# EAGLE schematic LEDController-REV2-SCH (EAGLE 9.7.0)

## Sheet 1 of 10
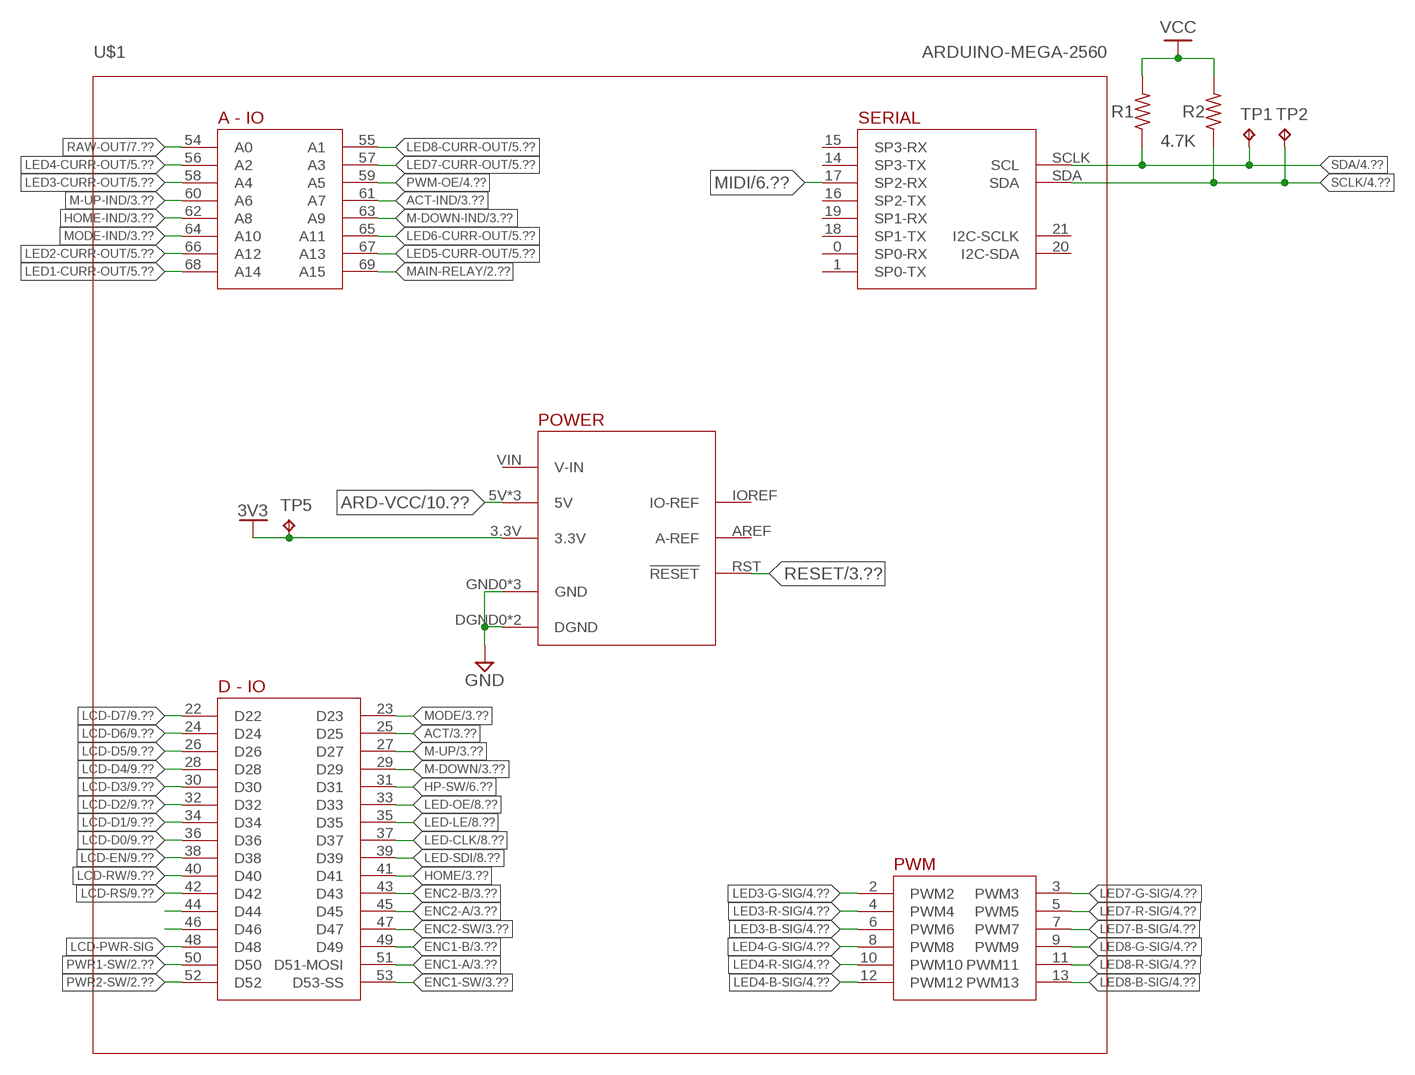
[diagram p0: schematic, sheet 1]

### Parts
R1  4.7K  R-US_CHIP-0805(2012-METRIC)  [RESC2012X65]
R2  4.7K  R-US_CHIP-0805(2012-METRIC)  [RESC2012X65]
TP1  TPTP10R  [TP10R]
TP2  TPTP10R  [TP10R]
TP5  TPTP10R  [TP10R]
U$1  ARDUINO-MEGA-2560  [ARDUINO-MEGA-2560]

### Nets
3V3: TP5.TP U$1.3.3V
ACT: U$1.25(D25) ; also sheet 3
ACT-IND: U$1.61(A7) ; also sheet 3
ARD-VCC: U$1.5V U$1.5VD1(5V) U$1.5VD2(5V) ; also sheet 10
ENC1-A: U$1.51(D51-MOSI) ; also sheet 3
ENC1-B: U$1.49(D49) ; also sheet 3
ENC1-SW: U$1.53(D53-SS) ; also sheet 3
ENC2-A: U$1.45(D45) ; also sheet 3
ENC2-B: U$1.43(D43) ; also sheet 3
ENC2-SW: U$1.47(D47) ; also sheet 3
GND: U$1.DGND0(DGND) U$1.DGND1(DGND) U$1.GND0(GND) U$1.GND1(GND) U$1.GND2(GND) ; also sheet 2,3,4,5,6,7,8,9,10
HOME: U$1.41(D41) ; also sheet 3
HOME-IND: U$1.62(A8) ; also sheet 3
HP-SW: U$1.31(D31) ; also sheet 6
LCD-D0: U$1.36(D36) ; also sheet 9
LCD-D1: U$1.34(D34) ; also sheet 9
LCD-D2: U$1.32(D32) ; also sheet 9
LCD-D3: U$1.30(D30) ; also sheet 9
LCD-D4: U$1.28(D28) ; also sheet 9
LCD-D5: U$1.26(D26) ; also sheet 9
LCD-D6: U$1.24(D24) ; also sheet 9
LCD-D7: U$1.22(D22) ; also sheet 9
LCD-EN: U$1.38(D38) ; also sheet 9
LCD-PWR-SIG: U$1.48(D48)
LCD-RS: U$1.42(D42) ; also sheet 9
LCD-RW: U$1.40(D40) ; also sheet 9
LED1-CURR-OUT: U$1.68(A14) ; also sheet 5
LED2-CURR-OUT: U$1.66(A12) ; also sheet 5
LED3-B-SIG: U$1.6(PWM6) ; also sheet 4
LED3-CURR-OUT: U$1.58(A4) ; also sheet 5
LED3-G-SIG: U$1.2(PWM2) ; also sheet 4
LED3-R-SIG: U$1.4(PWM4) ; also sheet 4
LED4-B-SIG: U$1.12(PWM12) ; also sheet 4
LED4-CURR-OUT: U$1.56(A2) ; also sheet 5
LED4-G-SIG: U$1.8(PWM8) ; also sheet 4
LED4-R-SIG: U$1.10(PWM10) ; also sheet 4
LED5-CURR-OUT: U$1.67(A13) ; also sheet 5
LED6-CURR-OUT: U$1.65(A11) ; also sheet 5
LED7-B-SIG: U$1.7(PWM7) ; also sheet 4
LED7-CURR-OUT: U$1.57(A3) ; also sheet 5
LED7-G-SIG: U$1.3(PWM3) ; also sheet 4
LED7-R-SIG: U$1.5(PWM5) ; also sheet 4
LED8-B-SIG: U$1.13(PWM13) ; also sheet 4
LED8-CURR-OUT: U$1.55(A1) ; also sheet 5
LED8-G-SIG: U$1.9(PWM9) ; also sheet 4
LED8-R-SIG: U$1.11(PWM11) ; also sheet 4
LED-CLK: U$1.37(D37) ; also sheet 8
LED-LE: U$1.35(D35) ; also sheet 8
LED-OE: U$1.33(D33) ; also sheet 8
LED-SDI: U$1.39(D39) ; also sheet 8
M-DOWN: U$1.29(D29) ; also sheet 3
M-DOWN-IND: U$1.63(A9) ; also sheet 3
M-UP: U$1.27(D27) ; also sheet 3
M-UP-IND: U$1.60(A6) ; also sheet 3
MAIN-RELAY: U$1.69(A15) ; also sheet 2
MIDI: U$1.17(SP2-RX) ; also sheet 6
MODE: U$1.23(D23) ; also sheet 3
MODE-IND: U$1.64(A10) ; also sheet 3
N$11: U$1.46(D46)
N$18: U$1.44(D44)
PWM-OE: U$1.59(A5) ; also sheet 4
PWR1-SW: U$1.50(D50) ; also sheet 2
PWR2-SW: U$1.52(D52) ; also sheet 2
RAW-OUT: U$1.54(A0) ; also sheet 7
RESET: U$1.RST(!RESET) ; also sheet 3
SCLK: R2.1 TP2.TP U$1.SDA ; also sheet 4
SDA: R1.1 TP1.TP U$1.SCLK(SCL) ; also sheet 4
VCC: R1.2 R2.2 ; also sheet 2,3,4,5,6,7,8,9,10
Unconnected: U$1.0(SP0-RX) U$1.1(SP0-TX) U$1.14(SP3-TX) U$1.15(SP3-RX) U$1.16(SP2-TX) U$1.18(SP1-TX) U$1.19(SP1-RX) U$1.20(I2C-SDA) U$1.21(I2C-SCLK) U$1.AREF(A-REF) U$1.IOREF(IO-REF) U$1.VIN(V-IN)

### Notes on the sheet
- 4.7K

## Sheet 2 of 10: Power Supply
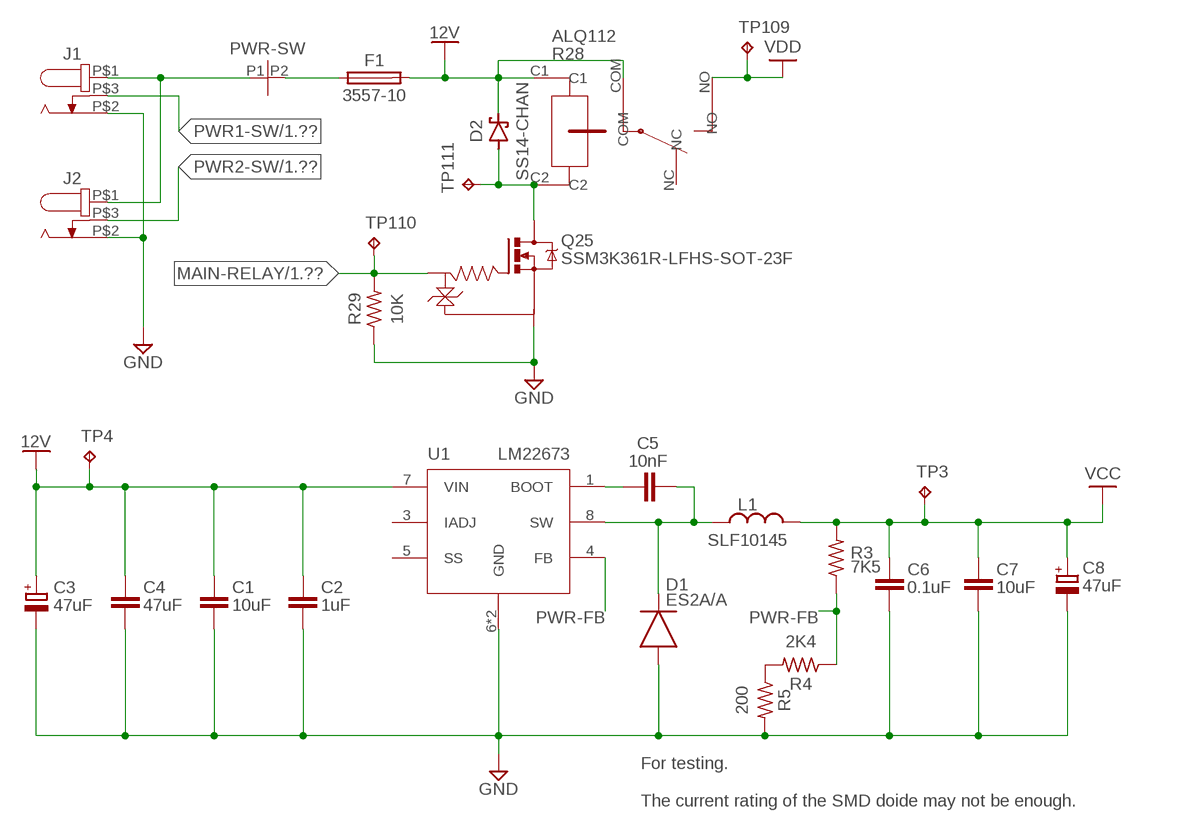
[diagram p1: schematic, sheet 2]

### Parts
C1  10uF  C_CHIP-1210(3225-METRIC)  [CAPC3225X135]
C2  1uF  C_CHIP-1210(3225-METRIC)  [CAPC3225X135]
C3  47uF  C-POL_ECAP-8.5MM  [CAPAE830X1050N]
C4  47uF  C_CHIP-1210(3225-METRIC)  [CAPC3225X135]
C5  10nF  C_CHIP-1210(3225-METRIC)  [CAPC3225X135]
C6  0.1uF  C_CHIP-1210(3225-METRIC)  [CAPC3225X135]
C7  10uF  C_CHIP-1210(3225-METRIC)  [CAPC3225X135]
C8  47uF  C-POL_ECAP-8.5MM  [CAPAE830X1050N]
D1  ES2A/A  [DIOM4326X250]
D2  SS14-CHAN  [SS14-CHAN]
F1  3557-10  [3557-10]
J1  KLDX-0202-A-BJACK  [KLDX-0202-A-HZ-BJACK]
J2  KLDX-0202-A-BJACK  [KLDX-0202-A-HZ-BJACK]
L1  SLF10145  [SLF10145]
PWR-SW  PWR-BREAKOUTSMALL  [PWR-BR-SM]
Q25  SSM3K361R-LFHS-SOT-23F  [HS-SOT-23F]
R3  7K5  RESISTOR1206  [RESC3216X70N]
R4  2K4  RESISTOR1206  [RESC3216X70N]
R5  200  RESISTOR1206  [RESC3216X70N]
R28  ALQ112  [ALQ112]
R29  10K  R-US_CHIP-0805(2012-METRIC)  [RESC2012X65]
TP3  TPTP10R  [TP10R]
TP4  TPTP10R  [TP10R]
TP109  TPTP10R  [TP10R]
TP110  TPTP10R  [TP10R]
TP111  TPTP10R  [TP10R]
U1  LM22673  [SOIC127P600X170-9T271X340N]

### Nets
12V: C1.1 C2.1 C3.1(+) C4.1 D2.C F1.P3 F1.P4 R28.C1 R28.COM TP4.TP U1.7(VIN)
GND: C1.2 C2.2 C3.2(-) C4.2 C6.2 C7.2 C8.2(-) D1.A J1.P$2 J2.P$2 Q25.2(S) R5.2 R29.1 U1.6(GND) U1.9(GND) ; also sheet 1,3,4,5,6,7,8,9,10
MAIN-RELAY: Q25.1(G) R29.2 TP110.TP ; also sheet 1
N$1: R4.2 R5.1
N$2: J1.P$1 J2.P$1 PWR-SW.P1
N$3: C5.2 D1.C L1.P$1 U1.8(SW)
N$5: C5.1 U1.1(BOOT)
N$17: F1.P1 F1.P2 PWR-SW.P2
N$19: D2.A Q25.3(D) R28.C2 TP111.TP
PWR1-SW: J1.P$3 ; also sheet 1
PWR2-SW: J2.P$3 ; also sheet 1
PWR-FB: R3.1 R4.1 U1.4(FB)
VCC: C6.1 C7.1 C8.1(+) L1.P$2 R3.2 TP3.TP ; also sheet 1,3,4,5,6,7,8,9,10
VDD: R28.NO TP109.TP ; also sheet 4,5
Unconnected: R28.NC U1.3(IADJ) U1.5(SS)

### Notes on the sheet
- For testing.
  
  The current rating of the SMD doide may not be enough.

## Sheet 3 of 10: Controls
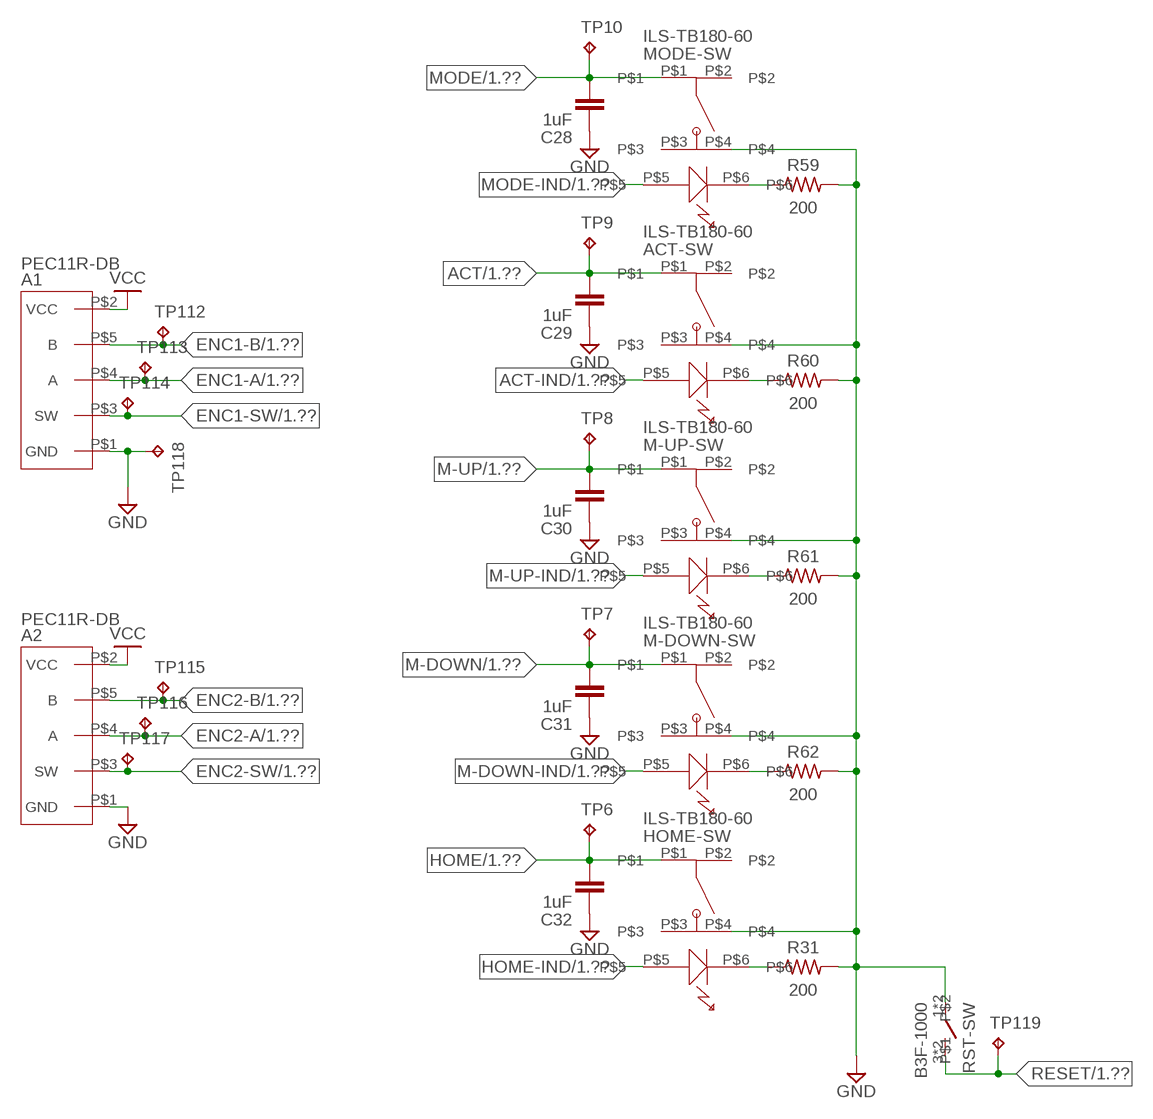
[diagram p2: schematic, sheet 3]

### Parts
A1  PEC11R-DB  [PEC11R-DB]
A2  PEC11R-DB  [PEC11R-DB]
ACT-SW  ILS-TB180-60  [ILS-TB]
C28  1uF  C_CHIP-1210(3225-METRIC)  [CAPC3225X135]
C29  1uF  C_CHIP-1210(3225-METRIC)  [CAPC3225X135]
C30  1uF  C_CHIP-1210(3225-METRIC)  [CAPC3225X135]
C31  1uF  C_CHIP-1210(3225-METRIC)  [CAPC3225X135]
C32  1uF  C_CHIP-1210(3225-METRIC)  [CAPC3225X135]
HOME-SW  ILS-TB180-60  [ILS-TB]
M-DOWN-SW  ILS-TB180-60  [ILS-TB]
M-UP-SW  ILS-TB180-60  [ILS-TB]
MODE-SW  ILS-TB180-60  [ILS-TB]
R31  200  RESISTOR1206  [RESC3216X70N]
R59  200  RESISTOR1206  [RESC3216X70N]
R60  200  RESISTOR1206  [RESC3216X70N]
R61  200  RESISTOR1206  [RESC3216X70N]
R62  200  RESISTOR1206  [RESC3216X70N]
RST-SW  B3F-1000  [B3F-10-SERIES]
TP6  TPTP10R  [TP10R]
TP7  TPTP10R  [TP10R]
TP8  TPTP10R  [TP10R]
TP9  TPTP10R  [TP10R]
TP10  TPTP10R  [TP10R]
TP112  TPTP10R  [TP10R]
TP113  TPTP10R  [TP10R]
TP114  TPTP10R  [TP10R]
TP115  TPTP10R  [TP10R]
TP116  TPTP10R  [TP10R]
TP117  TPTP10R  [TP10R]
TP118  TPTP10R  [TP10R]
TP119  TPTP10R  [TP10R]

### Nets
ACT: ACT-SW.P$1 C29.2 TP9.TP ; also sheet 1
ACT-IND: ACT-SW.P$5 ; also sheet 1
ENC1-A: A1.P$4(A) TP113.TP ; also sheet 1
ENC1-B: A1.P$5(B) TP112.TP ; also sheet 1
ENC1-SW: A1.P$3(SW) TP114.TP ; also sheet 1
ENC2-A: A2.P$4(A) TP116.TP ; also sheet 1
ENC2-B: A2.P$5(B) TP115.TP ; also sheet 1
ENC2-SW: A2.P$3(SW) TP117.TP ; also sheet 1
GND: A1.P$1(GND) A2.P$1(GND) ACT-SW.P$4 C28.1 C29.1 C30.1 C31.1 C32.1 HOME-SW.P$4 M-DOWN-SW.P$4 M-UP-SW.P$4 MODE-SW.P$4 R31.2 R59.2 R60.2 R61.2 R62.2 RST-SW.1 RST-SW.2 TP118.TP ; also sheet 1,2,4,5,6,7,8,9,10
HOME: C32.2 HOME-SW.P$1 TP6.TP ; also sheet 1
HOME-IND: HOME-SW.P$5 ; also sheet 1
M-DOWN: C31.2 M-DOWN-SW.P$1 TP7.TP ; also sheet 1
M-DOWN-IND: M-DOWN-SW.P$5 ; also sheet 1
M-UP: C30.2 M-UP-SW.P$1 TP8.TP ; also sheet 1
M-UP-IND: M-UP-SW.P$5 ; also sheet 1
MODE: C28.2 MODE-SW.P$1 TP10.TP ; also sheet 1
MODE-IND: MODE-SW.P$5 ; also sheet 1
N$13: HOME-SW.P$6 R31.1
N$20: MODE-SW.P$6 R59.1
N$46: ACT-SW.P$6 R60.1
N$47: M-UP-SW.P$6 R61.1
N$49: M-DOWN-SW.P$6 R62.1
RESET: RST-SW.3 RST-SW.4 TP119.TP ; also sheet 1
VCC: A1.P$2(VCC) A2.P$2(VCC) ; also sheet 1,2,4,5,6,7,8,9,10
Unconnected: ACT-SW.P$2 ACT-SW.P$3 HOME-SW.P$2 HOME-SW.P$3 M-DOWN-SW.P$2 M-DOWN-SW.P$3 M-UP-SW.P$2 M-UP-SW.P$3 MODE-SW.P$2 MODE-SW.P$3

## Sheet 4 of 10: LED Output
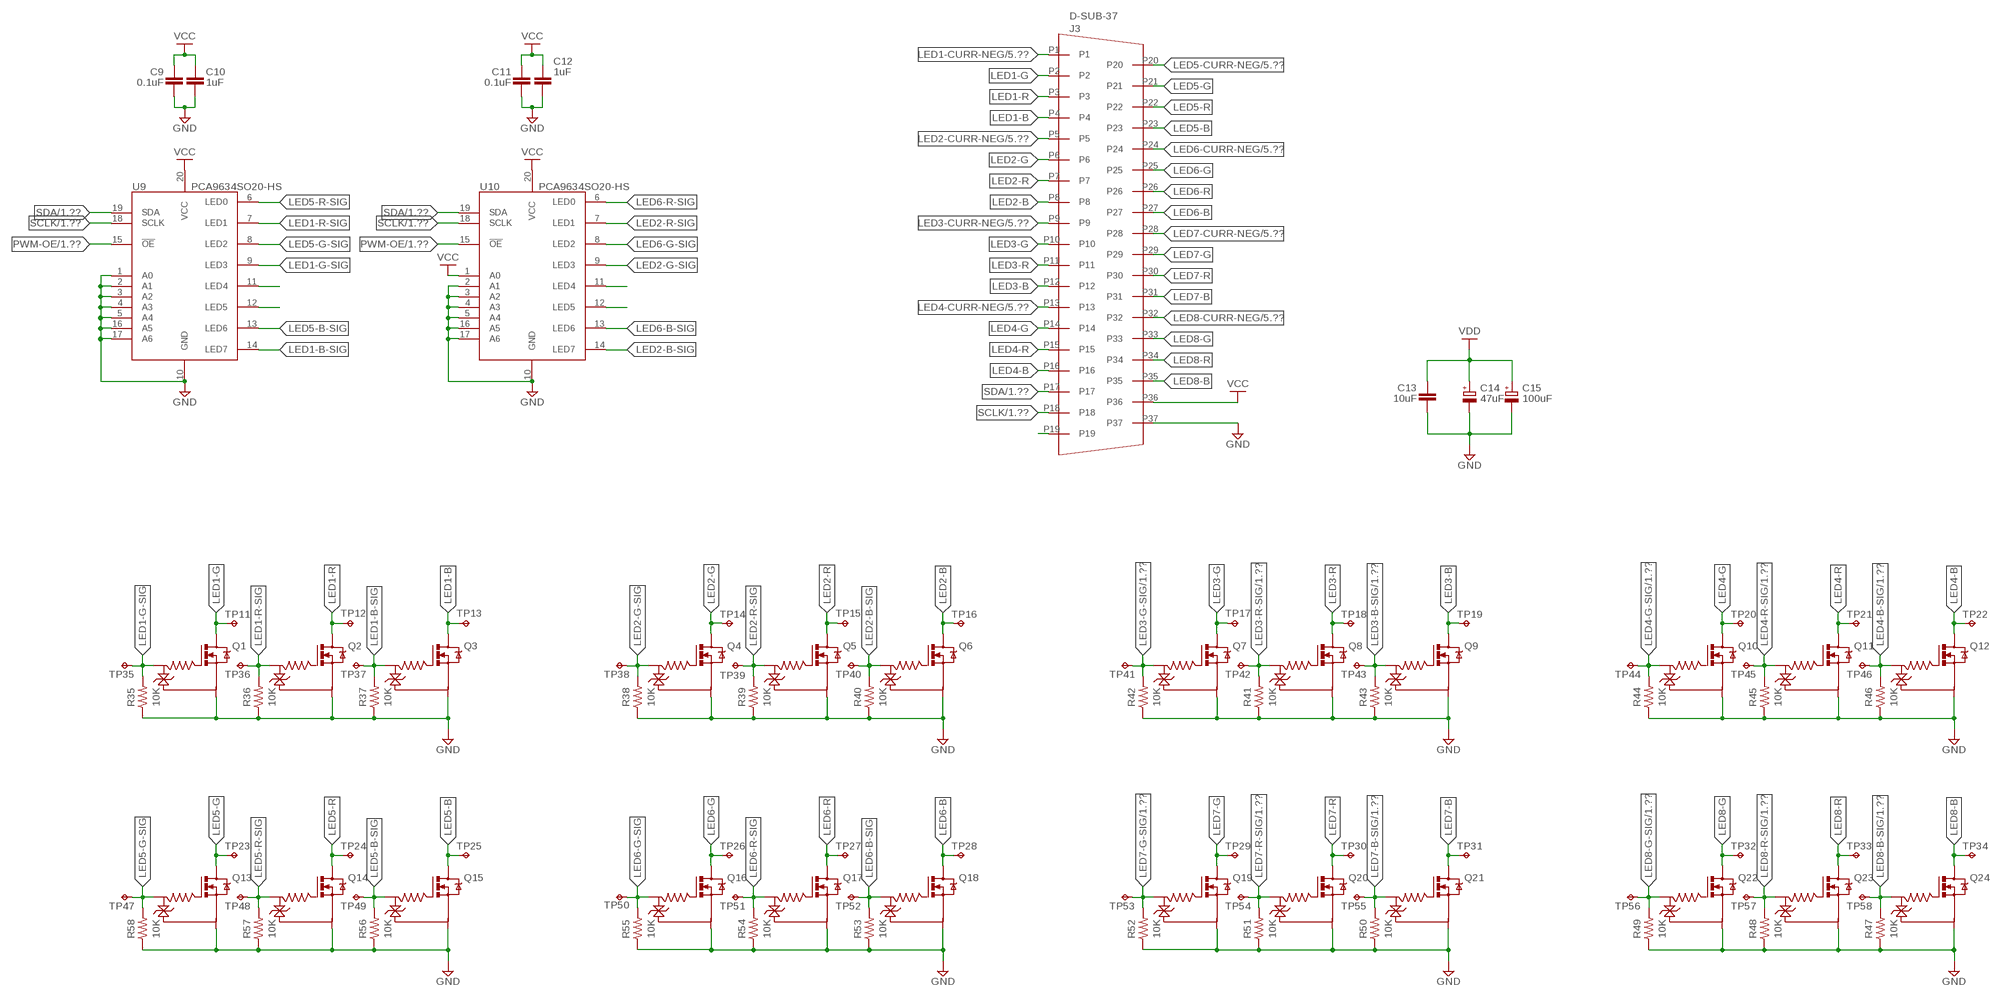
[diagram p3: schematic, sheet 4]

### Parts
C9  0.1uF  C_CHIP-1210(3225-METRIC)  [CAPC3225X135]
C10  1uF  C_CHIP-1210(3225-METRIC)  [CAPC3225X135]
C11  0.1uF  C_CHIP-1210(3225-METRIC)  [CAPC3225X135]
C12  1uF  C_CHIP-1210(3225-METRIC)  [CAPC3225X135]
C13  10uF  C_CHIP-1210(3225-METRIC)  [CAPC3225X135]
C14  47uF  C-POL_ECAP-8.5MM  [CAPAE830X1050N]
C15  100uF  C-POL_ECAP-10.5MM  [CAPAE1030X1050N]
J3  D-SUB-37  [D-SUB-37]
Q1  SSM3K361R-LFHS-SOT-23F  [HS-SOT-23F]
Q2  SSM3K361R-LFHS-SOT-23F  [HS-SOT-23F]
Q3  SSM3K361R-LFHS-SOT-23F  [HS-SOT-23F]
Q4  SSM3K361R-LFHS-SOT-23F  [HS-SOT-23F]
Q5  SSM3K361R-LFHS-SOT-23F  [HS-SOT-23F]
Q6  SSM3K361R-LFHS-SOT-23F  [HS-SOT-23F]
Q7  SSM3K361R-LFHS-SOT-23F  [HS-SOT-23F]
Q8  SSM3K361R-LFHS-SOT-23F  [HS-SOT-23F]
Q9  SSM3K361R-LFHS-SOT-23F  [HS-SOT-23F]
Q10  SSM3K361R-LFHS-SOT-23F  [HS-SOT-23F]
Q11  SSM3K361R-LFHS-SOT-23F  [HS-SOT-23F]
Q12  SSM3K361R-LFHS-SOT-23F  [HS-SOT-23F]
Q13  SSM3K361R-LFHS-SOT-23F  [HS-SOT-23F]
Q14  SSM3K361R-LFHS-SOT-23F  [HS-SOT-23F]
Q15  SSM3K361R-LFHS-SOT-23F  [HS-SOT-23F]
Q16  SSM3K361R-LFHS-SOT-23F  [HS-SOT-23F]
Q17  SSM3K361R-LFHS-SOT-23F  [HS-SOT-23F]
Q18  SSM3K361R-LFHS-SOT-23F  [HS-SOT-23F]
Q19  SSM3K361R-LFHS-SOT-23F  [HS-SOT-23F]
Q20  SSM3K361R-LFHS-SOT-23F  [HS-SOT-23F]
Q21  SSM3K361R-LFHS-SOT-23F  [HS-SOT-23F]
Q22  SSM3K361R-LFHS-SOT-23F  [HS-SOT-23F]
Q23  SSM3K361R-LFHS-SOT-23F  [HS-SOT-23F]
Q24  SSM3K361R-LFHS-SOT-23F  [HS-SOT-23F]
R35  10K  R-US_CHIP-1206(3216-METRIC)  [RESC3216X70]
R36  10K  R-US_CHIP-1206(3216-METRIC)  [RESC3216X70]
R37  10K  R-US_CHIP-1206(3216-METRIC)  [RESC3216X70]
R38  10K  R-US_CHIP-1206(3216-METRIC)  [RESC3216X70]
R39  10K  R-US_CHIP-1206(3216-METRIC)  [RESC3216X70]
R40  10K  R-US_CHIP-1206(3216-METRIC)  [RESC3216X70]
R41  10K  R-US_CHIP-1206(3216-METRIC)  [RESC3216X70]
R42  10K  R-US_CHIP-1206(3216-METRIC)  [RESC3216X70]
R43  10K  R-US_CHIP-1206(3216-METRIC)  [RESC3216X70]
R44  10K  R-US_CHIP-1206(3216-METRIC)  [RESC3216X70]
R45  10K  R-US_CHIP-1206(3216-METRIC)  [RESC3216X70]
R46  10K  R-US_CHIP-1206(3216-METRIC)  [RESC3216X70]
R47  10K  R-US_CHIP-1206(3216-METRIC)  [RESC3216X70]
R48  10K  R-US_CHIP-1206(3216-METRIC)  [RESC3216X70]
R49  10K  R-US_CHIP-1206(3216-METRIC)  [RESC3216X70]
R50  10K  R-US_CHIP-1206(3216-METRIC)  [RESC3216X70]
R51  10K  R-US_CHIP-1206(3216-METRIC)  [RESC3216X70]
R52  10K  R-US_CHIP-1206(3216-METRIC)  [RESC3216X70]
R53  10K  R-US_CHIP-1206(3216-METRIC)  [RESC3216X70]
R54  10K  R-US_CHIP-1206(3216-METRIC)  [RESC3216X70]
R55  10K  R-US_CHIP-1206(3216-METRIC)  [RESC3216X70]
R56  10K  R-US_CHIP-1206(3216-METRIC)  [RESC3216X70]
R57  10K  R-US_CHIP-1206(3216-METRIC)  [RESC3216X70]
R58  10K  R-US_CHIP-1206(3216-METRIC)  [RESC3216X70]
TP11  TPTP10R  [TP10R]
TP12  TPTP10R  [TP10R]
TP13  TPTP10R  [TP10R]
TP14  TPTP10R  [TP10R]
TP15  TPTP10R  [TP10R]
TP16  TPTP10R  [TP10R]
TP17  TPTP10R  [TP10R]
TP18  TPTP10R  [TP10R]
TP19  TPTP10R  [TP10R]
TP20  TPTP10R  [TP10R]
TP21  TPTP10R  [TP10R]
TP22  TPTP10R  [TP10R]
TP23  TPTP10R  [TP10R]
TP24  TPTP10R  [TP10R]
TP25  TPTP10R  [TP10R]
TP26  TPTP10R  [TP10R]
TP27  TPTP10R  [TP10R]
TP28  TPTP10R  [TP10R]
TP29  TPTP10R  [TP10R]
TP30  TPTP10R  [TP10R]
TP31  TPTP10R  [TP10R]
TP32  TPTP10R  [TP10R]
TP33  TPTP10R  [TP10R]
TP34  TPTP10R  [TP10R]
TP35  TPTP10R  [TP10R]
TP36  TPTP10R  [TP10R]
TP37  TPTP10R  [TP10R]
TP38  TPTP10R  [TP10R]
TP39  TPTP10R  [TP10R]
TP40  TPTP10R  [TP10R]
TP41  TPTP10R  [TP10R]
TP42  TPTP10R  [TP10R]
TP43  TPTP10R  [TP10R]
TP44  TPTP10R  [TP10R]
TP45  TPTP10R  [TP10R]
TP46  TPTP10R  [TP10R]
TP47  TPTP10R  [TP10R]
TP48  TPTP10R  [TP10R]
TP49  TPTP10R  [TP10R]
TP50  TPTP10R  [TP10R]
TP51  TPTP10R  [TP10R]
TP52  TPTP10R  [TP10R]
TP53  TPTP10R  [TP10R]
TP54  TPTP10R  [TP10R]
TP55  TPTP10R  [TP10R]
TP56  TPTP10R  [TP10R]
TP57  TPTP10R  [TP10R]
TP58  TPTP10R  [TP10R]
U9  PCA9634SO20-HS  [SO20-127P1032X265-20N-HS]
U10  PCA9634SO20-HS  [SO20-127P1032X265-20N-HS]

### Nets
GND: C9.2 C10.2 C11.2 C12.2 C13.2 C14.2(-) C15.2(-) J3.P37 Q1.2(S) Q2.2(S) Q3.2(S) Q4.2(S) Q5.2(S) Q6.2(S) Q7.2(S) Q8.2(S) Q9.2(S) Q10.2(S) Q11.2(S) Q12.2(S) Q13.2(S) Q14.2(S) Q15.2(S) Q16.2(S) Q17.2(S) Q18.2(S) Q19.2(S) Q20.2(S) Q21.2(S) Q22.2(S) Q23.2(S) Q24.2(S) R35.1 R36.1 R37.1 R38.1 R39.1 R40.1 R41.1 R42.1 R43.1 R44.1 R45.1 R46.1 R47.1 R48.1 R49.1 R50.1 R51.1 R52.1 R53.1 R54.1 R55.1 R56.1 R57.1 R58.1 U9.1(A0) U9.2(A1) U9.3(A2) U9.4(A3) U9.5(A4) U9.10(GND) U9.16(A5) U9.17(A6) U10.2(A1) U10.3(A2) U10.4(A3) U10.5(A4) U10.10(GND) U10.16(A5) U10.17(A6) ; also sheet 1,2,3,5,6,7,8,9,10
LED1-B: J3.P4 Q3.3(D) TP13.TP
LED1-B-SIG: Q3.1(G) R37.2 TP37.TP U9.14(LED7)
LED1-CURR-NEG: J3.P1 ; also sheet 5
LED1-G: J3.P2 Q1.3(D) TP11.TP
LED1-G-SIG: Q1.1(G) R35.2 TP35.TP U9.9(LED3)
LED1-R: J3.P3 Q2.3(D) TP12.TP
LED1-R-SIG: Q2.1(G) R36.2 TP36.TP U9.7(LED1)
LED2-B: J3.P8 Q6.3(D) TP16.TP
LED2-B-SIG: Q6.1(G) R40.2 TP40.TP U10.14(LED7)
LED2-CURR-NEG: J3.P5 ; also sheet 5
LED2-G: J3.P6 Q4.3(D) TP14.TP
LED2-G-SIG: Q4.1(G) R38.2 TP38.TP U10.9(LED3)
LED2-R: J3.P7 Q5.3(D) TP15.TP
LED2-R-SIG: Q5.1(G) R39.2 TP39.TP U10.7(LED1)
LED3-B: J3.P12 Q9.3(D) TP19.TP
LED3-B-SIG: Q9.1(G) R43.2 TP43.TP ; also sheet 1
LED3-CURR-NEG: J3.P9 ; also sheet 5
LED3-G: J3.P10 Q7.3(D) TP17.TP
LED3-G-SIG: Q7.1(G) R42.2 TP41.TP ; also sheet 1
LED3-R: J3.P11 Q8.3(D) TP18.TP
LED3-R-SIG: Q8.1(G) R41.2 TP42.TP ; also sheet 1
LED4-B: J3.P16 Q12.3(D) TP22.TP
LED4-B-SIG: Q12.1(G) R46.2 TP46.TP ; also sheet 1
LED4-CURR-NEG: J3.P13 ; also sheet 5
LED4-G: J3.P14 Q10.3(D) TP20.TP
LED4-G-SIG: Q10.1(G) R44.2 TP44.TP ; also sheet 1
LED4-R: J3.P15 Q11.3(D) TP21.TP
LED4-R-SIG: Q11.1(G) R45.2 TP45.TP ; also sheet 1
LED5-B: J3.P23 Q15.3(D) TP25.TP
LED5-B-SIG: Q15.1(G) R56.2 TP49.TP U9.13(LED6)
LED5-CURR-NEG: J3.P20 ; also sheet 5
LED5-G: J3.P21 Q13.3(D) TP23.TP
LED5-G-SIG: Q13.1(G) R58.2 TP47.TP U9.8(LED2)
LED5-R: J3.P22 Q14.3(D) TP24.TP
LED5-R-SIG: Q14.1(G) R57.2 TP48.TP U9.6(LED0)
LED6-B: J3.P27 Q18.3(D) TP28.TP
LED6-B-SIG: Q18.1(G) R53.2 TP52.TP U10.13(LED6)
LED6-CURR-NEG: J3.P24 ; also sheet 5
LED6-G: J3.P25 Q16.3(D) TP26.TP
LED6-G-SIG: Q16.1(G) R55.2 TP50.TP U10.8(LED2)
LED6-R: J3.P26 Q17.3(D) TP27.TP
LED6-R-SIG: Q17.1(G) R54.2 TP51.TP U10.6(LED0)
LED7-B: J3.P31 Q21.3(D) TP31.TP
LED7-B-SIG: Q21.1(G) R50.2 TP55.TP ; also sheet 1
LED7-CURR-NEG: J3.P28 ; also sheet 5
LED7-G: J3.P29 Q19.3(D) TP29.TP
LED7-G-SIG: Q19.1(G) R52.2 TP53.TP ; also sheet 1
LED7-R: J3.P30 Q20.3(D) TP30.TP
LED7-R-SIG: Q20.1(G) R51.2 TP54.TP ; also sheet 1
LED8-B: J3.P35 Q24.3(D) TP34.TP
LED8-B-SIG: Q24.1(G) R47.2 TP58.TP ; also sheet 1
LED8-CURR-NEG: J3.P32 ; also sheet 5
LED8-G: J3.P33 Q22.3(D) TP32.TP
LED8-G-SIG: Q22.1(G) R49.2 TP56.TP ; also sheet 1
LED8-R: J3.P34 Q23.3(D) TP33.TP
LED8-R-SIG: Q23.1(G) R48.2 TP57.TP ; also sheet 1
N$30: J3.P19
N$59: U9.11(LED4)
N$60: U9.12(LED5)
N$67: U10.11(LED4)
N$68: U10.12(LED5)
PWM-OE: U9.15(!OE) U10.15(!OE) ; also sheet 1
SCLK: J3.P18 U9.18(SCLK) U10.18(SCLK) ; also sheet 1
SDA: J3.P17 U9.19(SDA) U10.19(SDA) ; also sheet 1
VCC: C9.1 C10.1 C11.1 C12.1 J3.P36 U9.20(VCC) U10.1(A0) U10.20(VCC) ; also sheet 1,2,3,5,6,7,8,9,10
VDD: C13.1 C14.1(+) C15.1(+) ; also sheet 2,5

## Sheet 5 of 10: LED Current Sense
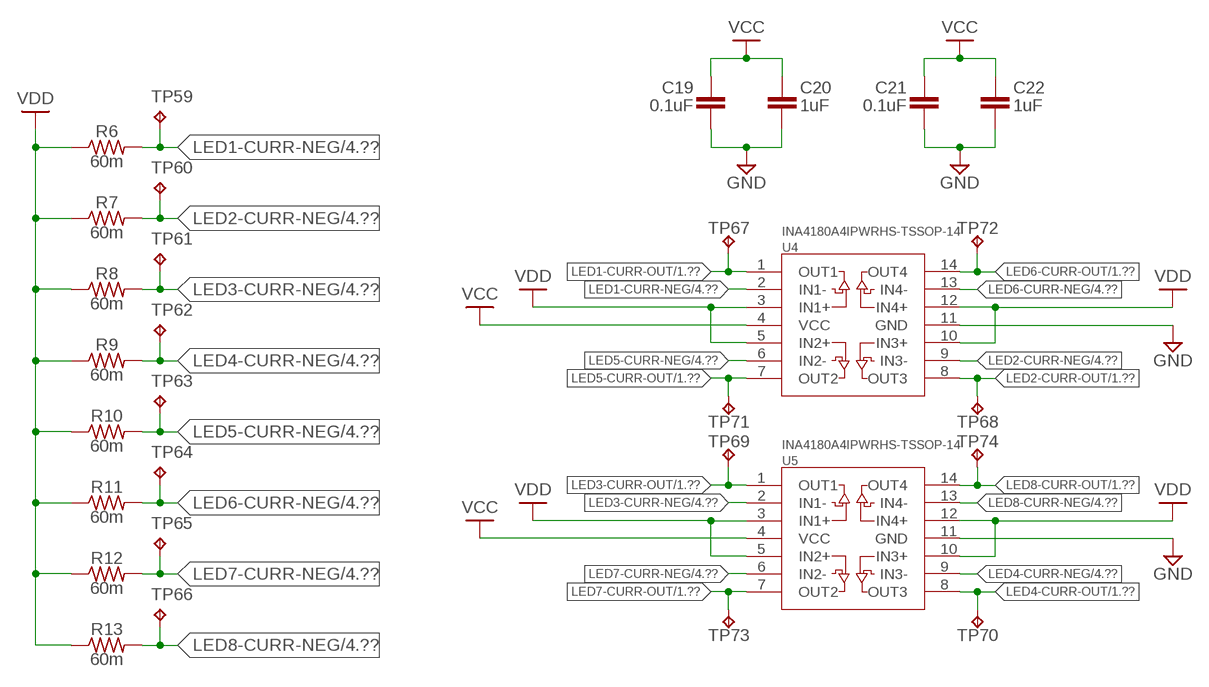
[diagram p4: schematic, sheet 5]

### Parts
C19  0.1uF  C_CHIP-1210(3225-METRIC)  [CAPC3225X135]
C20  1uF  C_CHIP-1210(3225-METRIC)  [CAPC3225X135]
C21  0.1uF  C_CHIP-1210(3225-METRIC)  [CAPC3225X135]
C22  1uF  C_CHIP-1210(3225-METRIC)  [CAPC3225X135]
R6  60m  R-US_CHIP-2512(6332-METRIC)  [RESC6332X71]
R7  60m  R-US_CHIP-2512(6332-METRIC)  [RESC6332X71]
R8  60m  R-US_CHIP-2512(6332-METRIC)  [RESC6332X71]
R9  60m  R-US_CHIP-2512(6332-METRIC)  [RESC6332X71]
R10  60m  R-US_CHIP-2512(6332-METRIC)  [RESC6332X71]
R11  60m  R-US_CHIP-2512(6332-METRIC)  [RESC6332X71]
R12  60m  R-US_CHIP-2512(6332-METRIC)  [RESC6332X71]
R13  60m  R-US_CHIP-2512(6332-METRIC)  [RESC6332X71]
TP59  TPTP10R  [TP10R]
TP60  TPTP10R  [TP10R]
TP61  TPTP10R  [TP10R]
TP62  TPTP10R  [TP10R]
TP63  TPTP10R  [TP10R]
TP64  TPTP10R  [TP10R]
TP65  TPTP10R  [TP10R]
TP66  TPTP10R  [TP10R]
TP67  TPTP10R  [TP10R]
TP68  TPTP10R  [TP10R]
TP69  TPTP10R  [TP10R]
TP70  TPTP10R  [TP10R]
TP71  TPTP10R  [TP10R]
TP72  TPTP10R  [TP10R]
TP73  TPTP10R  [TP10R]
TP74  TPTP10R  [TP10R]
U4  INA4180A4IPWRHS-TSSOP-14  [HS-TSSOP-14]
U5  INA4180A4IPWRHS-TSSOP-14  [HS-TSSOP-14]

### Nets
GND: C19.2 C20.2 C21.2 C22.2 U4.11(GND) U5.11(GND) ; also sheet 1,2,3,4,6,7,8,9,10
LED1-CURR-NEG: R6.2 TP59.TP U4.2(IN1-) ; also sheet 4
LED1-CURR-OUT: TP67.TP U4.1(OUT1) ; also sheet 1
LED2-CURR-NEG: R7.2 TP60.TP U4.9(IN3-) ; also sheet 4
LED2-CURR-OUT: TP68.TP U4.8(OUT3) ; also sheet 1
LED3-CURR-NEG: R8.2 TP61.TP U5.2(IN1-) ; also sheet 4
LED3-CURR-OUT: TP69.TP U5.1(OUT1) ; also sheet 1
LED4-CURR-NEG: R9.2 TP62.TP U5.9(IN3-) ; also sheet 4
LED4-CURR-OUT: TP70.TP U5.8(OUT3) ; also sheet 1
LED5-CURR-NEG: R10.2 TP63.TP U4.6(IN2-) ; also sheet 4
LED5-CURR-OUT: TP71.TP U4.7(OUT2) ; also sheet 1
LED6-CURR-NEG: R11.2 TP64.TP U4.13(IN4-) ; also sheet 4
LED6-CURR-OUT: TP72.TP U4.14(OUT4) ; also sheet 1
LED7-CURR-NEG: R12.2 TP65.TP U5.6(IN2-) ; also sheet 4
LED7-CURR-OUT: TP73.TP U5.7(OUT2) ; also sheet 1
LED8-CURR-NEG: R13.2 TP66.TP U5.13(IN4-) ; also sheet 4
LED8-CURR-OUT: TP74.TP U5.14(OUT4) ; also sheet 1
VCC: C19.1 C20.1 C21.1 C22.1 U4.4(VCC) U5.4(VCC) ; also sheet 1,2,3,4,6,7,8,9,10
VDD: R6.1 R7.1 R8.1 R9.1 R10.1 R11.1 R12.1 R13.1 U4.3(IN1+) U4.5(IN2+) U4.10(IN3+) U4.12(IN4+) U5.3(IN1+) U5.5(IN2+) U5.10(IN3+) U5.12(IN4+) ; also sheet 2,4

## Sheet 6 of 10: Audio Inputs
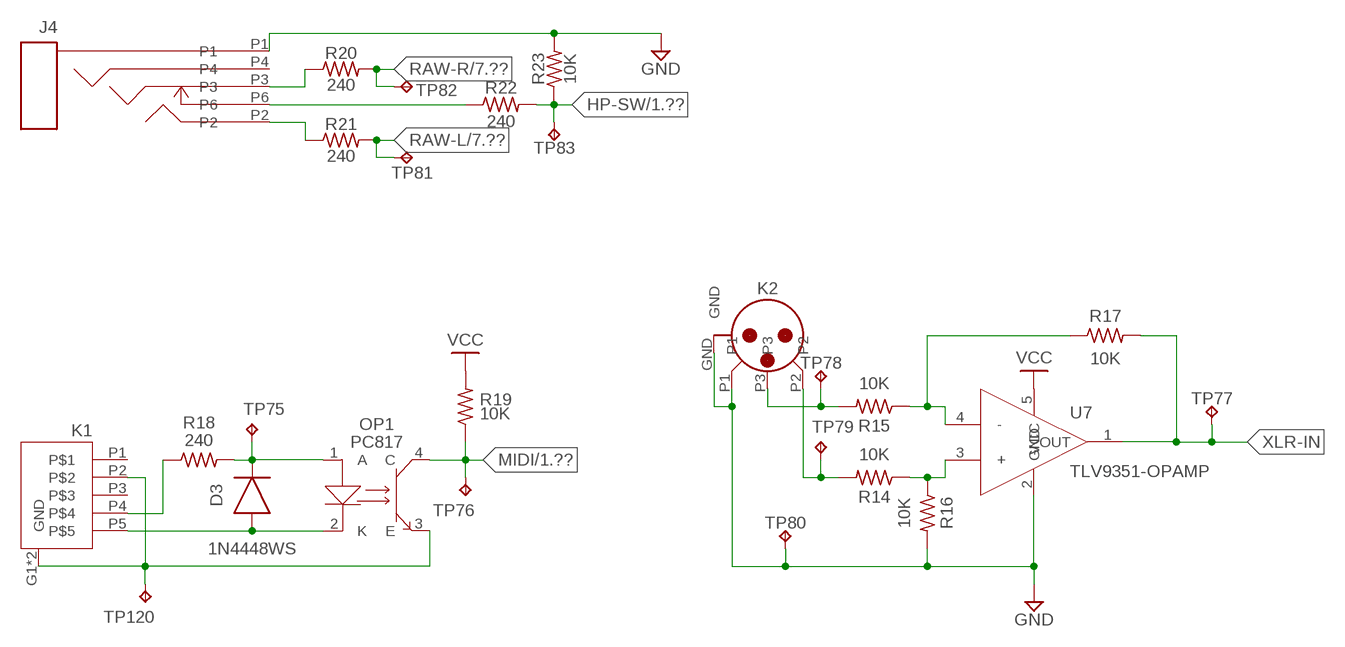
[diagram p5: schematic, sheet 6]

### Parts
D3  1N4448WS  [SOD2412X120N]
J4  SJ-43515RS-SMT-TR  [SJ-43515RS-SMT-TR]
K1  DIN-5  [57PC5FS]
K2  E3FRAQG-XLR-FEMALE  [E3FRA-XLR-F]
OP1  PC817  [DIP762W51P254L458H450Q4B]
R14  10K  R-US_CHIP-1206(3216-METRIC)  [RESC3216X70]
R15  10K  R-US_CHIP-1206(3216-METRIC)  [RESC3216X70]
R16  10K  R-US_CHIP-1206(3216-METRIC)  [RESC3216X70]
R17  10K  R-US_CHIP-1206(3216-METRIC)  [RESC3216X70]
R18  240  R-US_CHIP-1206(3216-METRIC)  [RESC3216X70]
R19  10K  R-US_CHIP-1206(3216-METRIC)  [RESC3216X70]
R20  240  R-US_CHIP-1206(3216-METRIC)  [RESC3216X70]
R21  240  R-US_CHIP-1206(3216-METRIC)  [RESC3216X70]
R22  240  R-US_CHIP-1206(3216-METRIC)  [RESC3216X70]
R23  10K  R-US_CHIP-1206(3216-METRIC)  [RESC3216X70]
TP75  TPTP10R  [TP10R]
TP76  TPTP10R  [TP10R]
TP77  TPTP10R  [TP10R]
TP78  TPTP10R  [TP10R]
TP79  TPTP10R  [TP10R]
TP80  TPTP10R  [TP10R]
TP81  TPTP10R  [TP10R]
TP82  TPTP10R  [TP10R]
TP83  TPTP10R  [TP10R]
TP120  TPTP10R  [TP10R]
U7  TLV9351-OPAMP  [SOT95P280X145-5N]

### Nets
GND: J4.P1 K2.GND K2.P1 R16.2 R23.2 TP80.TP U7.2(GND) ; also sheet 1,2,3,4,5,7,8,9,10
HP-SW: R22.2 R23.1 TP83.TP ; also sheet 1
MIDI: OP1.4(C) R19.1 TP76.TP ; also sheet 1
MIDI-GND: K1.G1(GND) K1.G2(GND) K1.P2 OP1.3(E) TP120.TP
N$6: D3.A K1.P5 OP1.2(K)
N$8: K1.P4 R18.1
N$9: D3.C OP1.1(A) R18.2 TP75.TP
N$10: K2.P3 R15.2 TP78.TP
N$14: K2.P2 R14.2 TP79.TP
N$15: R14.1 R16.1 U7.3(+)
N$16: R15.1 R17.1 U7.4(-)
N$21: J4.P3 R20.1
N$24: J4.P6 R22.1
N$25: J4.P2 R21.1
RAW-L: R21.2 TP81.TP ; also sheet 7
RAW-R: R20.2 TP82.TP ; also sheet 7
VCC: R19.2 U7.5(VCC) ; also sheet 1,2,3,4,5,7,8,9,10
XLR-IN: R17.2 TP77.TP U7.1(OUT)
Unconnected: J4.P4 K1.P1 K1.P3

## Sheet 7 of 10: Audio Processing
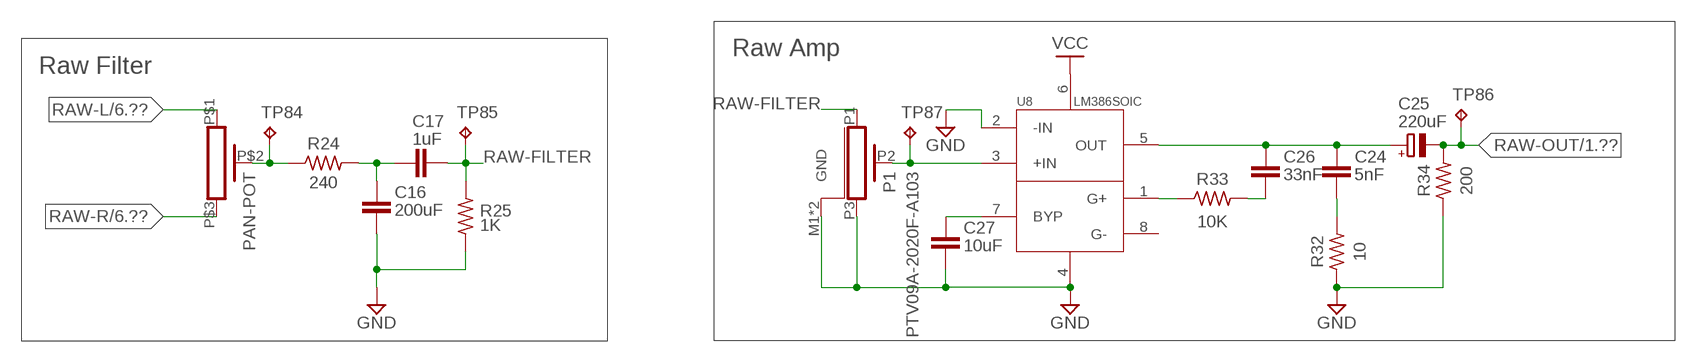
[diagram p6: schematic, sheet 7]

### Parts
C16  200uF  C_CHIP-1210(3225-METRIC)  [CAPC3225X135]
C17  1uF  C_CHIP-1210(3225-METRIC)  [CAPC3225X135]
C24  5nF  C_CHIP-1210(3225-METRIC)  [CAPC3225X135]
C25  220uF  C-POL_ECAP-8.5MM  [CAPAE830X1050N]
C26  33nF  C_CHIP-1210(3225-METRIC)  [CAPC3225X135]
C27  10uF  C_CHIP-1210(3225-METRIC)  [CAPC3225X135]
P1  PTV09A-2020F-A103  [PTV09A-2020F]
PAN-POT  CHEAP-POT  [CHEAP-POT]
R24  240  R-US_CHIP-1206(3216-METRIC)  [RESC3216X70]
R25  1K  R-US_CHIP-1206(3216-METRIC)  [RESC3216X70]
R32  10  R-US_CHIP-1206(3216-METRIC)  [RESC3216X70]
R33  10K  R-US_CHIP-1206(3216-METRIC)  [RESC3216X70]
R34  200  R-US_CHIP-1206(3216-METRIC)  [RESC3216X70]
TP84  TPTP10R  [TP10R]
TP85  TPTP10R  [TP10R]
TP86  TPTP10R  [TP10R]
TP87  TPTP10R  [TP10R]
U8  LM386SOIC  [SOIC127P599X175-8N]

### Nets
GND: C16.2 C27.2 P1.M1(GND) P1.M2(GND) P1.P3 R25.1 R32.1 R34.1 U8.2(-IN) U8.4(GND) ; also sheet 1,2,3,4,5,6,8,9,10
N$22: PAN-POT.P$2 R24.1 TP84.TP
N$23: C26.2 R33.2
N$26: C16.1 C17.1 R24.2
N$48: C24.1 C25.1(+) C26.1 U8.5(OUT)
N$51: C24.2 R32.2
N$52: R33.1 U8.1(G+)
N$53: C27.1 U8.7(BYP)
N$54: P1.P2 TP87.TP U8.3(+IN)
RAW-FILTER: C17.2 P1.P1 R25.2 TP85.TP
RAW-L: PAN-POT.P$1 ; also sheet 6
RAW-OUT: C25.2(-) R34.2 TP86.TP ; also sheet 1
RAW-R: PAN-POT.P$3 ; also sheet 6
VCC: U8.6(VCC) ; also sheet 1,2,3,4,5,6,8,9,10
Unconnected: U8.8(G-)

### Notes on the sheet
- Raw Amp
- Raw Filter

## Sheet 8 of 10: Bar Graph & Ind LEDs
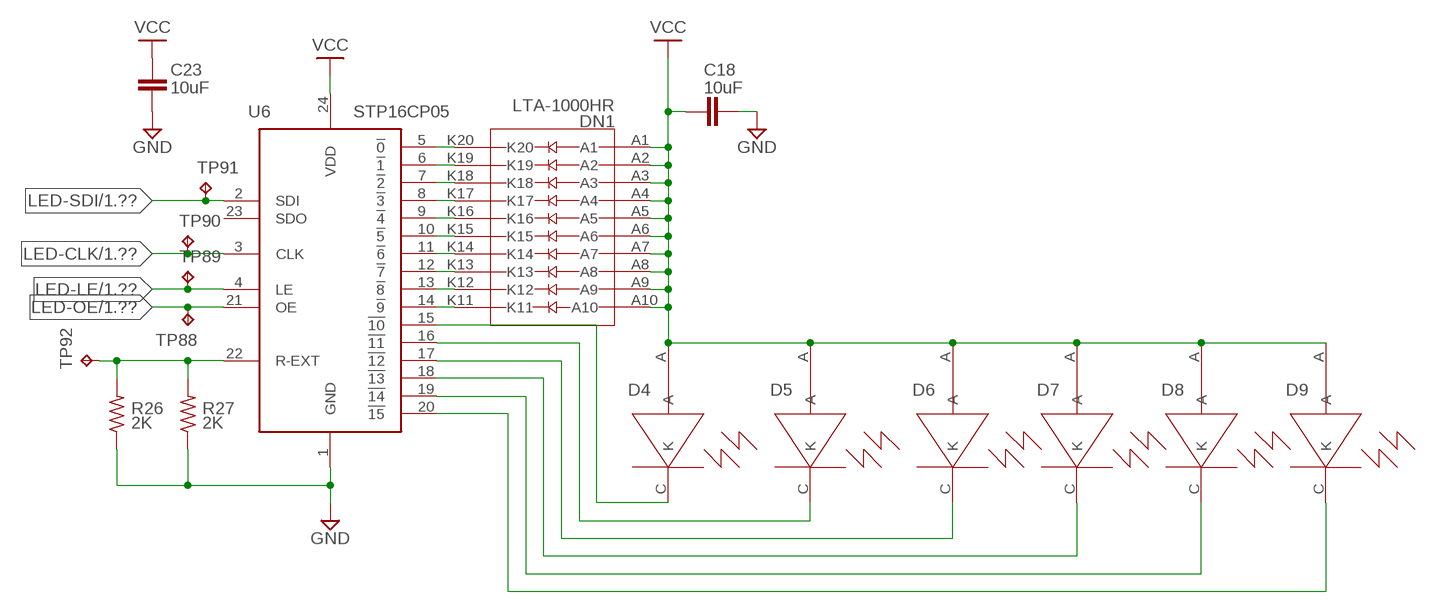
[diagram p7: schematic, sheet 8]

### Parts
C18  10uF  C_CHIP-1210(3225-METRIC)  [CAPC3225X135]
C23  10uF  C_CHIP-1210(3225-METRIC)  [CAPC3225X135]
D4  2PLCC-LED  [LEDC3528X190N]
D5  2PLCC-LED  [LEDC3528X190N]
D6  2PLCC-LED  [LEDC3528X190N]
D7  2PLCC-LED  [LEDC3528X190N]
D8  2PLCC-LED  [LEDC3528X190N]
D9  2PLCC-LED  [LEDC3528X190N]
DN1  LTA-1000HR  [LTA-1000HR]
R26  2K  R-US_CHIP-1206(3216-METRIC)  [RESC3216X70]
R27  2K  R-US_CHIP-1206(3216-METRIC)  [RESC3216X70]
TP88  TPTP10R  [TP10R]
TP89  TPTP10R  [TP10R]
TP90  TPTP10R  [TP10R]
TP91  TPTP10R  [TP10R]
TP92  TPTP10R  [TP10R]
U6  STP16CP05  [SOIC127P1032X265-24N]

### Nets
GND: C18.2 C23.2 R26.1 R27.1 U6.1(GND) ; also sheet 1,2,3,4,5,6,7,9,10
LED-CLK: TP90.TP U6.3(CLK) ; also sheet 1
LED-LE: TP89.TP U6.4(LE) ; also sheet 1
LED-OE: TP88.TP U6.21(OE) ; also sheet 1
LED-SDI: TP91.TP U6.2(SDI) ; also sheet 1
N$27: DN1.K11 U6.14(!9)
N$28: DN1.K12 U6.13(!8)
N$29: DN1.K13 U6.12(!7)
N$31: DN1.K14 U6.11(!6)
N$32: DN1.K15 U6.10(!5)
N$33: DN1.K16 U6.9(!4)
N$34: DN1.K17 U6.8(!3)
N$35: DN1.K18 U6.7(!2)
N$36: DN1.K19 U6.6(!1)
N$37: DN1.K20 U6.5(!0)
N$38: D4.C(K) U6.15(!10)
N$39: D5.C(K) U6.16(!11)
N$40: D6.C(K) U6.17(!12)
N$41: D7.C(K) U6.18(!13)
N$42: D8.C(K) U6.19(!14)
N$43: D9.C(K) U6.20(!15)
N$50: R26.2 R27.2 TP92.TP U6.22(R-EXT)
VCC: C18.1 C23.1 D4.A D5.A D6.A D7.A D8.A D9.A DN1.A1 DN1.A2 DN1.A3 DN1.A4 DN1.A5 DN1.A6 DN1.A7 DN1.A8 DN1.A9 DN1.A10 U6.24(VDD) ; also sheet 1,2,3,4,5,6,7,9,10
Unconnected: U6.23(SDO)

## Sheet 9 of 10: LCD Screen
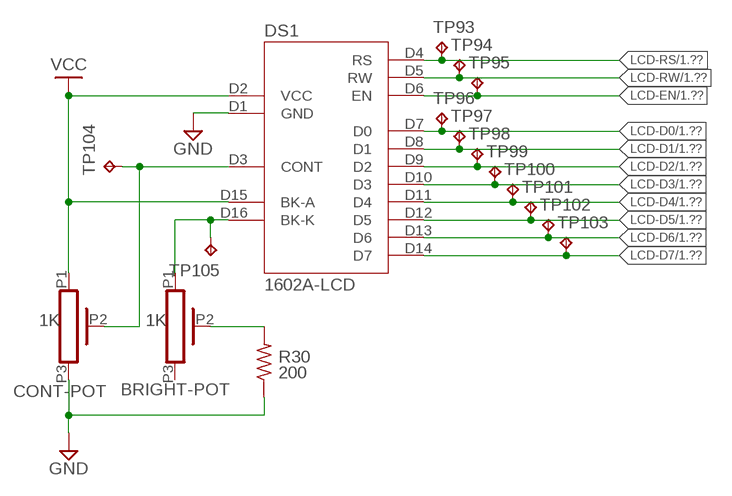
[diagram p8: schematic, sheet 9]

### Parts
BRIGHT-POT  PT10LV10_TPOT  [PT10LV10]
CONT-POT  PT10LV10_TPOT  [PT10LV10]
DS1  1602A-LCD  [1602A-LCD]
R30  200  R-US_CHIP-1206(3216-METRIC)  [RESC3216X70]
TP93  TPTP10R  [TP10R]
TP94  TPTP10R  [TP10R]
TP95  TPTP10R  [TP10R]
TP96  TPTP10R  [TP10R]
TP97  TPTP10R  [TP10R]
TP98  TPTP10R  [TP10R]
TP99  TPTP10R  [TP10R]
TP100  TPTP10R  [TP10R]
TP101  TPTP10R  [TP10R]
TP102  TPTP10R  [TP10R]
TP103  TPTP10R  [TP10R]
TP104  TPTP10R  [TP10R]
TP105  TPTP10R  [TP10R]

### Nets
BK-K: BRIGHT-POT.P1 DS1.D16(BK-K) TP105.TP
GND: CONT-POT.P3 DS1.D1(GND) R30.1 ; also sheet 1,2,3,4,5,6,7,8,10
LCD-CONT: CONT-POT.P2 DS1.D3(CONT) TP104.TP
LCD-D0: DS1.D7(D0) TP96.TP ; also sheet 1
LCD-D1: DS1.D8(D1) TP97.TP ; also sheet 1
LCD-D2: DS1.D9(D2) TP98.TP ; also sheet 1
LCD-D3: DS1.D10(D3) TP99.TP ; also sheet 1
LCD-D4: DS1.D11(D4) TP100.TP ; also sheet 1
LCD-D5: DS1.D12(D5) TP101.TP ; also sheet 1
LCD-D6: DS1.D13(D6) TP102.TP ; also sheet 1
LCD-D7: DS1.D14(D7) TP103.TP ; also sheet 1
LCD-EN: DS1.D6(EN) TP95.TP ; also sheet 1
LCD-RS: DS1.D4(RS) TP93.TP ; also sheet 1
LCD-RW: DS1.D5(RW) TP94.TP ; also sheet 1
N$45: BRIGHT-POT.P2 R30.2
VCC: CONT-POT.P1 DS1.D2(VCC) DS1.D15(BK-A) ; also sheet 1,2,3,4,5,6,7,8,10
Unconnected: BRIGHT-POT.P3

### Notes on the sheet
- 1K | 1K

## Sheet 10 of 10: BackPower Protector
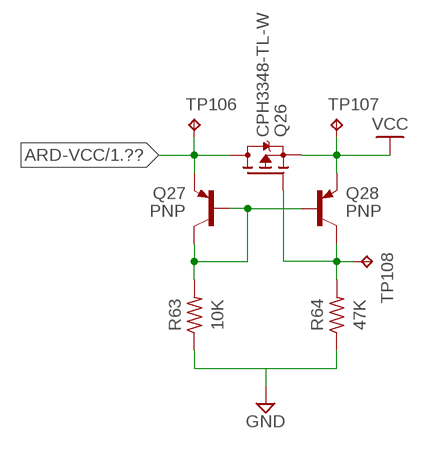
[diagram p9: schematic, sheet 10]

### Parts
Q26  CPH3348-TL-W  [SOT95P280X120-3N]
Q27  PNP  PNP_SOT23  [SOT95P237X112-3N]
Q28  PNP  PNP_SOT23  [SOT95P237X112-3N]
R63  10K  R-US_CHIP-0805(2012-METRIC)  [RESC2012X65]
R64  47K  R-US_CHIP-0805(2012-METRIC)  [RESC2012X65]
TP106  TPTP10R  [TP10R]
TP107  TPTP10R  [TP10R]
TP108  TPTP10R  [TP10R]

### Nets
ARD-VCC: Q26.3(D) Q27.2(E) TP106.TP ; also sheet 1
GND: R63.1 R64.1 ; also sheet 1,2,3,4,5,6,7,8,9
N$55: Q27.1(B) Q27.3(C) Q28.1(B) R63.2
N$56: Q26.1(G) Q28.3(C) R64.2 TP108.TP
VCC: Q26.2(S) Q28.2(E) TP107.TP ; also sheet 1,2,3,4,5,6,7,8,9

## Library data of the parts
A1 A2 = Parts Library:PEC11R-DB: Rotary Encoder Daughter Board; CATEGORY: Input; DATASHEET: https://www.bourns.com/docs/Product-Datasheets/PEC11R.pdf; SUB-CATEGORY: Rotary-Encoder
ACT-SW HOME-SW M-DOWN-SW M-UP-SW MODE-SW = Button Library:ILS-TB180-60: Illuminated Switch Switch with a built-in LED.; CATEGORY: Input; DATASHEET: https://www.ckswitches.com/media/2865/ils.pdf; SUB-CATEGORY: Switch; SWITCHTYPE: Tactile
BRIGHT-POT CONT-POT = Parts Library:PT10LV10_TPOT: Trim POT; CATEGORY: Potentiometer; DATASHEET: https://www.piher.net/pdf/12-PT10v03.pdf; SUB-CATEGORY: Trimmer
C1 C2 C4-C7 C9-C13 C16-C24 C26-C32 = Capacitor:C: Capacitor - Generic; CATEGORY: Capacitor
C3 C8 C14 C15 C25 = Capacitor:C-POL: Capacitor Polarised - Generic; CATEGORY: Capacitor
D1 = Diode Library:ES2A/A: Super Fast Rectifier Diode SMD Package: SMA/SMB; CATEGORY: Diode; DATASHEET: https://www.onsemi.com/pdf/datasheet/es2d-d.pdf; SUB-CATEGORY: Fast-Rectifier
D2 = Diode Library:SS14-CHAN: SMD Schottky I (AV) : 1A V (RRM) : 40V
D3 = Diode Library:1N4448WS: Small Signal Diode Small SMD general purp diode. Package: SOD323; CATEGORY: Diode; DATASHEET: https://rocelec.widen.net/view/pdf/tf3dlteblx/FAIR-S-A0000573112-1.pdf?t.download=true&u=5oefqw; SUB-CATEGORY: General
D4-D9 = Parts Library:2PLCC-LED: SMD LED Small LED that provides a decent brightness for its size.; CATEGORY: LED; SUB-CATEGORY: Indicator
DN1 = Parts Library:LTA-1000HR: LED Bar Graph 10 LED Red Bar Graph module.; CATEGORY: LED; DATASHEET: https://optoelectronics.liteon.com/upload/download/DS-30-92-0810/LTA-1000HR.pdf; SUB-CATEGORY: Bar-Graph
DS1 = Parts Library:1602A-LCD: 16-Char 2-Line Character LCD Screen; CATEGORY: Screen; DATASHEET: https://www.ibselectronics.com/ibsstore/datasheet/LCM1602A.pdf; SUB-CATEGORY: LCD
F1 = Passives Library:3557-10
J1 J2 = Parts Library:KLDX-0202-A-BJACK: Barrel Jack; CATEGORY: Connector; DATASHEET: http://www.kycon.com/2013Catalogpage/DC%20Power/KLDX_0202_LT.pdf; SUB-CATEGORY: Power
J3 = Connector Library:D-SUB-37
J4 = Connector Library:SJ-43515RS-SMT-TR: 1/8 Headphone Jack; CATEGORY: Connector; CONN-TYPE: Female; DATASHEET: https://www.cuidevices.com/product/resource/sj-4351x-smt.pdf; JACK: 1/8; PINS: 5; SUB-CATEGORY: Audio-Jack
K1 = Connector Library:DIN-5
K2 = Connector Library:E3FRAQG-XLR-FEMALE
L1 = Passives Library:SLF10145
OP1 = Parts Library:PC817: Opto Isolator From Chip kit on amazon.; CATEGORY: IC; DATASHEET: http://www.socle-tech.com/doc/IC%20Channel%20Product/Optoelectronic%20Components/Photocoupler/PC817X_NSZ9FSeries_SPEC.pdf; SUB-CATEGORY: Isolator
P1 = Button Library:PTV09A-2020F-A103; CATEGORY: Input; DATASHEET: https://www.bourns.com/docs/Product-Datasheets/PTV09.pdf; RANGE: 1K; SUB-CATEGORY: Potentiometer
PAN-POT = Parts Library:CHEAP-POT: Basic Potentiometer Basic Cheap Pot from the kits; CATEGORY: Input; SUB-CATEGORY: Potentiometer
PWR-SW = Parts Library:PWR-BREAKOUT
Q1-Q25 = Parts Library:SSM3K361R-LF: N-Channel 100 V 3.5A (Ta) 1.2W (Ta) Surface Mount SOT-23F
Q26 = Parts Library:CPH3348-TL-W: 12V P Ch MOSFET; CATEGORY: MOSFET; DATASHEET: https://rocelec.widen.net/view/pdf/0p2cmbdrr3/ONSM-S-A0001342044-1.pdf?t.download=true&u=5oefqw; GATETYPE: P; SUB-CATEGORY: Signal
Q27 Q28 = Transistor:PNP: PNP - Generic; CATEGORY: Transistor; SUB-CATEGORY: BJT; TYPE: PNP
R1 R2 R6-R27 R29 R30 R32-R58 R63 R64 = Resistor:R-US: Resistor Fixed - ANSI; CATEGORY: Resistor; SUB-CATEGORY: Fixed
R3-R5 R31 R59-R62 = Passives Library:RESISTOR
R28 = Parts Library:ALQ112; CATEGORY: Relay; SUBCATEGORY: Power
RST-SW = Button Library:B3F-1000; CATEGORY: Input; DATASHEET: https://omronfs.omron.com/en_US/ecb/products/pdf/en-b3f.pdf; SUB-CATEGORY: Switch; SWITCHTYPE: Tactile
TP1-TP120 = testpad:TP: Test pad
U1 = Parts Library:LM22673: 42V 3A Switching Voltage Regutator; CATEGORY: IC; DATASHEET: https://www.ti.com/lit/ds/symlink/lm22673.pdf?HQS=dis-dk-null-digikeymode-dsf-pf-null-wwe&ts=1643525451948&ref_url=https%253A%252F%252Fwww.ti.com%252Fgeneral%252Fdocs%252Fsuppproductinfo.tsp%253FdistId%253D10%2526gotoUrl%253Dhttps%253A%252F%252Fwww.ti.com%252Flit%252Fgpn%252Flm22673; REGTYPE: Switching; SUB-CATEGORY: Regulator
U4 U5 = Parts Library:INA4180A4IPWR: 4 Ch Current Shunt Amplifier
U6 = Parts Library:STP16CP05: 16-bit LED Shift Register LED driver that controls 16 individual LEDs using a shift register. Current output can be configured with an external resistor. controls LED ground. Cant push much current!; CATEGORY: IC; CHANNELS: 16; DATASHEET: https://www.st.com/content/ccc/resource/technical/document/datasheet/f2/92/00/f9/dd/4a/43/22/CD00126634.pdf/files/CD00126634.pdf/jcr:content/translations/en.CD00126634.pdf; SERIAL: Shift-Register; SUB-CATEGORY: Driver
U7 = Parts Library:TLV9351-OPAMP: SOT-23 OPAMP Cheap, small, simple opamp Features: Rail-To-Rail Operation MUX Friendly Cost Effective Low noise, offest voltage, & bias current; CATEGORY: IC; CHANNELS: 1; DATASHEET: https://www.ti.com/lit/ds/symlink/tlv9354.pdf?HQS=dis-dk-null-digikeymode-dsf-pf-null-wwe&ts=1643526319646; SUB-CATEGORY: Opamp
U8 = Parts Library:LM386
U9 U10 = Parts Library:PCA9634: 8 Bit I2C PWM LED Driver I2C Communication Bus 8 Channels 8 Bit PWM Control per Channel Individual Totem-Pole/Open-Drain Selection 97kHz Channel Frequency 25mA Per Channel 3.3V or 5V VCC Changeable Addresses
U$1 = ArduinoLibrary:ARDUINO-MEGA-2560; ANALOG: 16; CATEGORY: Arduino; DIGITAL: 54; PWM: 12; SUB-CATEGORY: Large